# Altium schematic sheet Sheet_1_2022-03-10.schdoc
size 197 x 128 mm
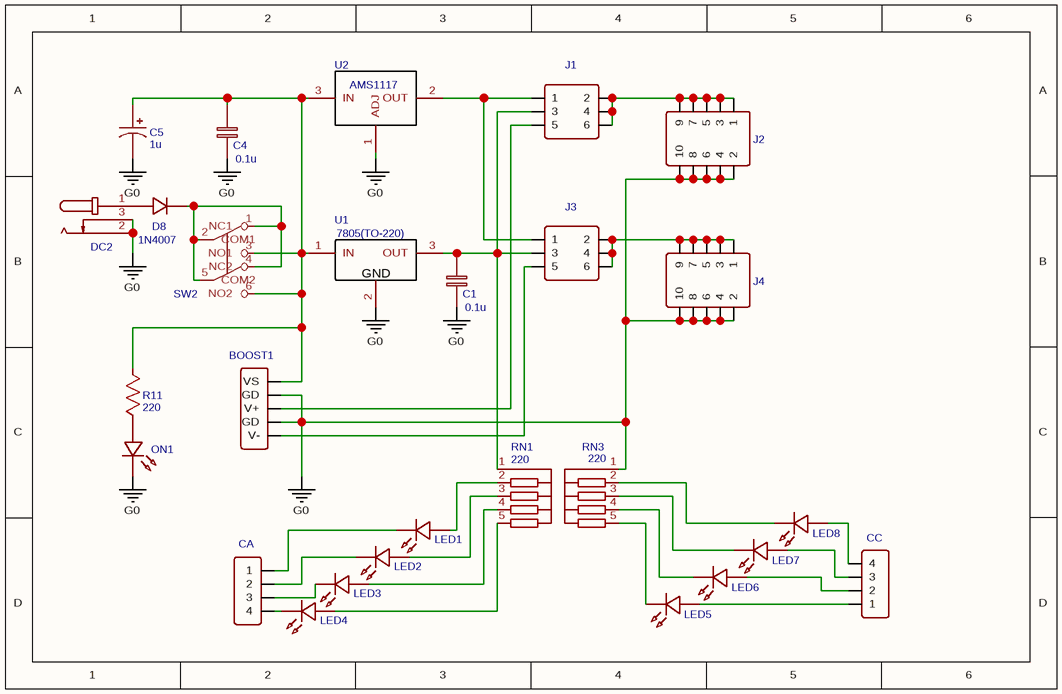
[diagram p0: Sheet_1_2022-03-10.schdoc]

## Parts
BOOST1  HDR-F-2.54_1x5  [DUAL_SUPPLY_BOOSTER]  (value not drawn)
C1  0.1u  [CAP200]
C4  0.1u  [CAP200]
C5  1u  [CAP-D6.3×F2.5]
CA  HDR-F-2.54_1x4  [HDR-F-2.54_1X4]  (value not drawn)
CC  HDR-F-2.54_1x4  [HDR-F-2.54_1X4]  (value not drawn)
D8  1N4007  [DO-41_BD2.4-L4.7-P8.70-D0.9-RD]
DC2  DC-072-165A  [DC-IN-TH_DC-072-165A]  (value not drawn)
J1  HDR-M-2.54_2x3  [HDR-M-2.54_2X3]  (value not drawn)
J2  HDR-M-2.54_2x5  [HDR-M-2.54_2X5]  (value not drawn)
J3  HDR-M-2.54_2x3  [HDR-M-2.54_2X3]  (value not drawn)
J4  HDR-M-2.54_2x5  [HDR-M-2.54_2X5]  (value not drawn)
LED1  LED-TH-3mm_R  [LED-TH_BD3.0_RED]  (value not drawn)
LED2  LED-TH-3mm_R  [LED-TH_BD3.0_RED]  (value not drawn)
LED3  LED-TH-3mm_R  [LED-TH_BD3.0_RED]  (value not drawn)
LED4  LED-TH-3mm_R  [LED-TH_BD3.0_RED]  (value not drawn)
LED5  LED-TH-3mm_R  [LED-TH_BD3.0_RED]  (value not drawn)
LED6  LED-TH-3mm_R  [LED-TH_BD3.0_RED]  (value not drawn)
LED7  LED-TH-3mm_R  [LED-TH_BD3.0_RED]  (value not drawn)
LED8  LED-TH-3mm_R  [LED-TH_BD3.0_RED]  (value not drawn)
ON1  LED-TH-3mm_B  [LED-TH_BD3.0_BLUE]  (value not drawn)
R11  220  [R_AXIAL-0.4]
RN1  220  [RES-ARRAY-TH_5P-P2.54-D1.0]
RN3  220  [RES-ARRAY-TH_5P-P2.54-D1.0]
SW2  SW_PUSH_DPDT  [SW_PUSH_BUTTON_MINI]  (value not drawn)
U1  7805(TO-220)  [HEATSINK]
U2  AMS1117  [SOT223]

## Nets
G0: BOOST1.2(GD) BOOST1.4(GD) C1.1 C4.1 C5.2 DC2.2 DC2.3 J2.2 J2.4 J2.6 J2.8 J2.10 J4.2 J4.4 J4.6 J4.8 J4.10 ON1.2 RN3.1 U1.2(GND) U2.1(ADJ)
NetBOOST1_1: BOOST1.1(VS) C4.2 C5.1 R11.2 SW2.3(NO1) SW2.6(NO2) U1.1(IN) U2.3(IN)
NetBOOST1_3: BOOST1.3(V+) J1.5
NetBOOST1_5: BOOST1.5(V-) J3.5
NetC1_2: C1.2 J1.3 J3.3 RN1.1 U1.3(OUT)
NetCA_1: CA.1 LED1.2
NetCA_2: CA.2 LED2.2
NetCA_3: CA.3 LED3.2
NetCA_4: CA.4 LED4.2
NetCC_1: CC.1 LED5.1
NetCC_2: CC.2 LED6.1
NetCC_3: CC.3 LED7.1
NetCC_4: CC.4 LED8.1
NetD8_1: D8.1 SW2.1(NC1) SW2.2(COM1) SW2.4(NC2) SW2.5(COM2)
NetD8_2: D8.2 DC2.1
NetJ1_1: J1.1 J3.1 U2.2(OUT)
NetJ1_2: J1.2 J1.4 J1.6 J2.1 J2.3 J2.5 J2.7 J2.9
NetJ3_2: J3.2 J3.4 J3.6 J4.1 J4.3 J4.5 J4.7 J4.9
NetLED1_1: LED1.1 RN1.2
NetLED2_1: LED2.1 RN1.3
NetLED3_1: LED3.1 RN1.4
NetLED4_1: LED4.1 RN1.5
NetLED5_2: LED5.2 RN3.5
NetLED6_2: LED6.2 RN3.4
NetLED7_2: LED7.2 RN3.3
NetLED8_2: LED8.2 RN3.2
NetON1_1: ON1.1 R11.1

## Library data of the parts
BOOST1 = HDR-F-2.54_1x5: Contributor: LCEDA_Lib; Package Display: No; BOM_Supplier Part: C50950; BOM_Supplier: LCSC; spicePre: H; spiceSymbolName: HDR-F-2.54_1x5
C1 C4 = 0.1u: nameAlias: Value(F); Contributor: LCEDA_Lib; spicePre: C; spiceSymbolName: C_RAD-0.2_EU
C5 = 1u: nameAlias: Value(F); Contributor: LCEDA_Lib; spicePre: C; spiceSymbolName: CE_TH_D6.3×F2.5_US
CA CC = HDR-F-2.54_1x4: Contributor: LCEDA_Lib; BOM_Supplier Part: C225501; BOM_Supplier: LCSC; spicePre: H; spiceSymbolName: HDR-F-2.54_1x4
D8 = 1N4007: BOM_Manufacturer: SEMTECH; Contributor: LCEDA_Lib; BOM_Supplier: LCSC; BOM_Manufacturer Part: 1N4007; BOM_Supplier Part: C106903; spicePre: D; spiceSymbolName: 1N4007
DC2 = DC-072-165A: BOM_Manufacturer: HRO; BOM_Supplier: LCSC; BOM_Manufacturer Part: DC-072-165A; BOM_Supplier Part: C129003; spicePre: D; spiceSymbolName: DC-072-165A
J1 J3 = HDR-M-2.54_2x3: Contributor: LCEDA_Lib; BOM_Supplier Part: C65114; BOM_Supplier: LCSC; spicePre: J; spiceSymbolName: HDR-M-2.54_2x3
J2 J4 = HDR-M-2.54_2x5: Contributor: LCEDA_Lib; BOM_Supplier Part: C178292; BOM_Supplier: LCSC; spicePre: J; spiceSymbolName: HDR-M-2.54_2x5
LED1-LED8 = LED-TH-3mm_R: BOM_Manufacturer: EVERLIGHT(台湾亿光); BOM_Manufacturer Part: 204-10SDRD/S530-A3-L; Contributor: LCEDA_Lib; BOM_Supplier Part: C84774; BOM_Supplier: LCSC; spicePre: L; spiceSymbolName: LED-TH-3mm_R
ON1 = LED-TH-3mm_B: BOM_Manufacturer: EVERLIGHT(台湾亿光); BOM_Manufacturer Part: 204-10SUBC/S400-A4; Contributor: LCEDA_Lib; BOM_Supplier Part: C86881; BOM_Supplier: LCSC; spicePre: L; spiceSymbolName: LED-TH-3mm_B
R11 = 220: nameAlias: Value(Ω); Contributor: LCEDA_Lib; spicePre: R; spiceSymbolName: R_AXIAL-0.4_US
RN1 RN3 = 220: BOM_Manufacturer: ZHUHAI MONEC ELEC; BOM_Manufacturer Part: RAA05472G; nameAlias: Resistance (Ohms); Contributor: LCSC; BOM_Supplier: LCSC; BOM_Supplier Part: C353598; spicePre: R; spiceSymbolName: RAA05472G
SW2 = SW_PUSH_DPDT: Contributor: DangerousPrototype; spicePre: S; spiceSymbolName: SW_PUSH_DPDT
U1 = 7805(TO-220): BOM_Manufacturer: STMicroelectronics; BOM_Manufacturer Part: L7805CV-DG; Contributor: LCEDA_Lib; BOM_Supplier: LCSC; BOM_Supplier Part: C3795; spicePre: U; spiceSymbolName: 7805(TO-220)
U2 = AMS1117: Contributor: GerryChen; sourceId: 0btnFXRxP; spicePre: U; spiceSymbolName: AMS1117